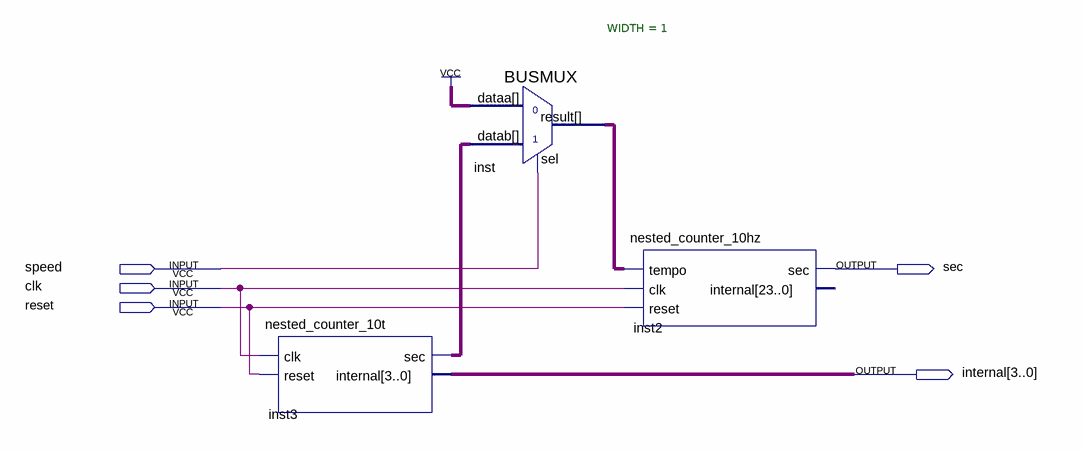
[diagram p0: schematic sheet]
// Quartus schematic nested_counter_sec.bdf as structural Verilog: 3 symbols, 5 pins
module nested_counter_sec (
  input  speed,
  input  clk,
  input  reset,
  output sec,
  output [3:0] internal
);

  wire inst3_sec, inst_result;

  nested_counter_10t inst3 (.clk(clk), .reset(reset), .sec(inst3_sec), .internal(internal));
  BUSMUX #(.WIDTH(1)) inst (.datab(inst3_sec), .sel(speed), .dataa(1'b1), .result(inst_result));
  nested_counter_10hz inst2 (.tempo(inst_result), .clk(clk), .reset(reset), .sec(sec));  // open: internal
endmodule
